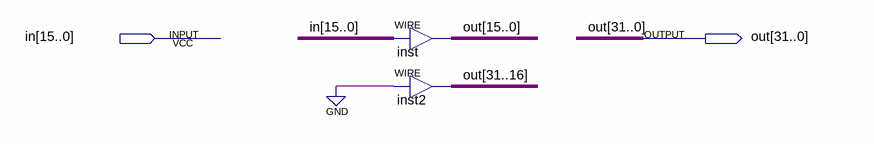
[diagram p0: schematic sheet]
// Quartus schematic ZeroExtent.bdf as structural Verilog: 2 symbols, 2 pins
module ZeroExtent (
  input  [15:0] in,
  output [31:0] out
);

  assign out[15:0] = in;  // WIRE inst
  assign out[31:16] = {16{1'b0}};  // WIRE inst2
endmodule
